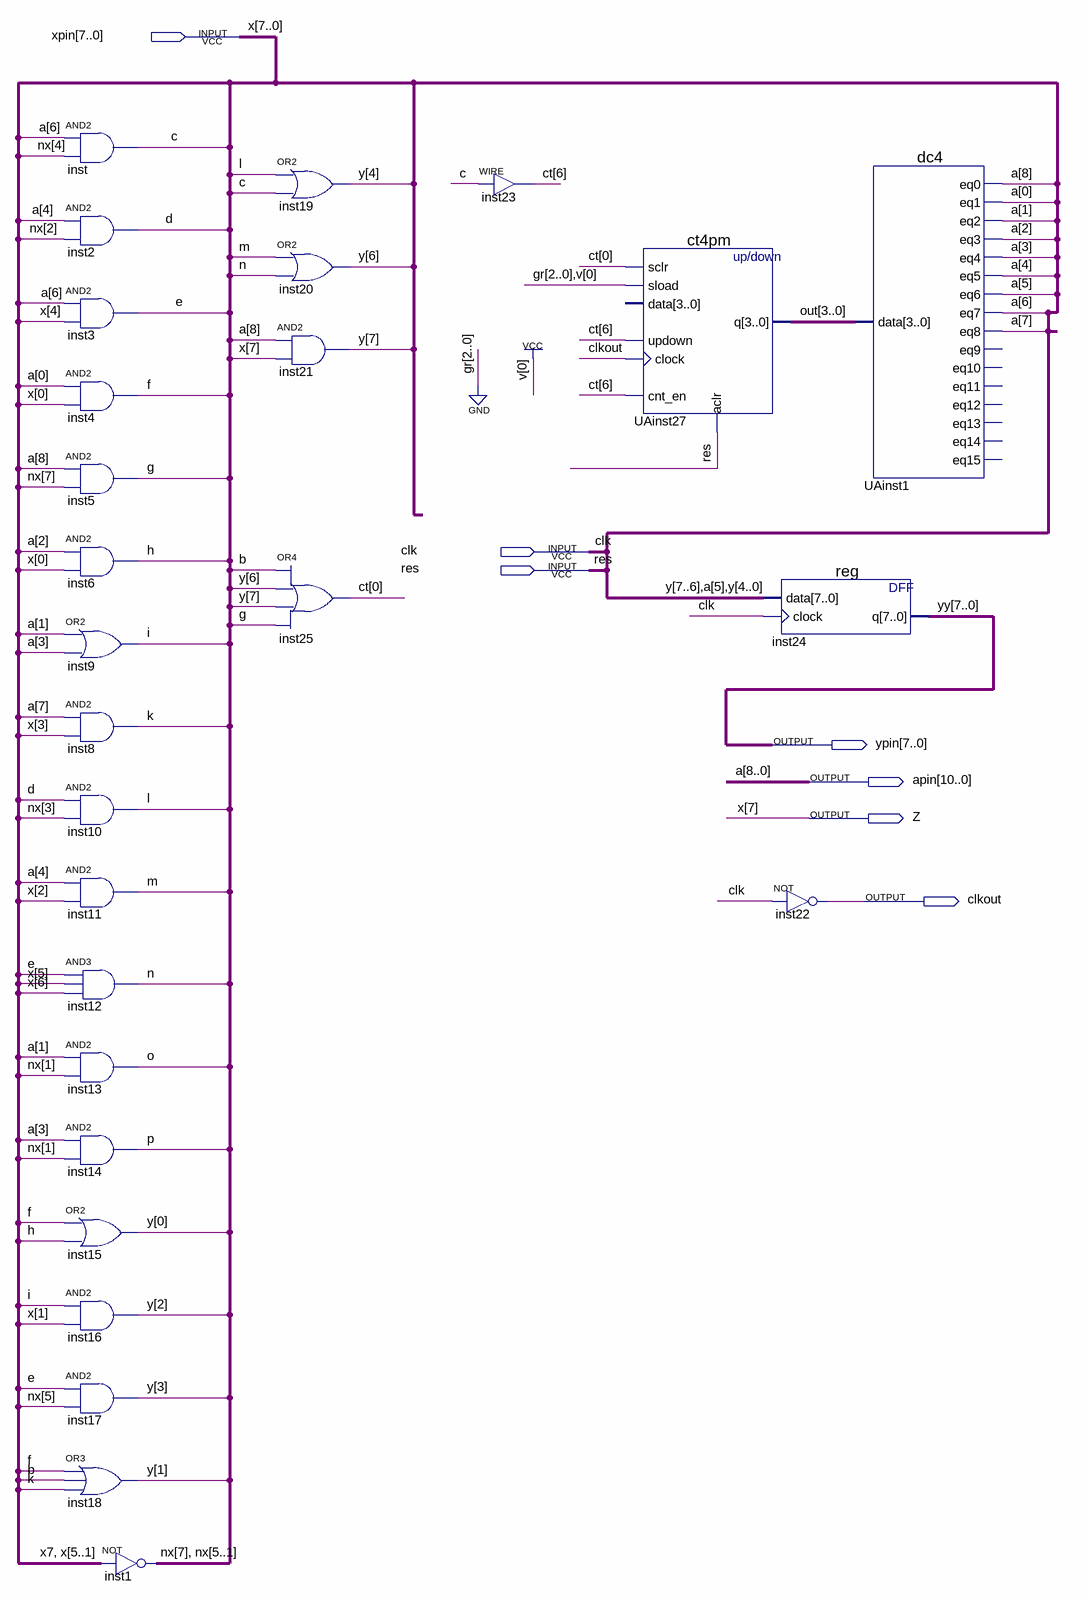
[diagram p0: schematic sheet]
// Quartus schematic Block1.bdf as structural Verilog: 27 symbols, 7 pins
module Block1 (
  input  [7:0] xpin,
  input  clk,
  input  res,
  output [7:0] ypin,
  output [10:0] apin,
  output Z,
  output clkout
);

  wire b, c, d, e, f, g, h, i, k, l, m, n, o, p;
  wire [3:0] out;
  wire [6:0] ct;
  wire [7:0] y;
  wire [7:1] nx;
  wire [8:0] a;

  and inst (c, a[6], nx[4]);
  and inst2 (d, a[4], nx[2]);
  and inst3 (e, a[6], xpin[4]);
  and inst4 (f, a[0], xpin[0]);
  and inst5 (g, a[8], nx[7]);
  and inst6 (h, a[2], xpin[0]);
  or inst9 (i, a[1], a[3]);
  and inst8 (k, a[7], xpin[3]);
  and inst10 (l, d, nx[3]);
  and inst11 (m, a[4], xpin[2]);
  and inst12 (n, e, xpin[5], xpin[6]);
  and inst13 (o, a[1], nx[1]);
  and inst14 (p, a[3], nx[1]);
  or inst15 (y[0], f, h);
  and inst16 (y[2], i, xpin[1]);
  and inst17 (y[3], e, nx[5]);
  or inst18 (y[1], f, b, k);
  assign {nx[7], nx[5:1]} = ~{xpin[7], xpin[5:1]};  // NOT inst1, 6 bits wide
  or inst19 (y[4], l, c);
  or inst20 (y[6], m, n);
  and inst21 (y[7], a[8], xpin[7]);
  or inst25 (ct[0], b, y[6], y[7], g);
  assign ct[6] = c;  // WIRE inst23
  ct4pm UAinst27 (
    .sclr(ct[0]), .sload(4'b0001), .updown(ct[6]), .clock(clkout), .cnt_en(ct[6]), .aclr(res), .q(out));  // open: data
  \reg  inst24 (.data({y[7:6], a[5], y[4:0]}), .clock(clk), .q(ypin));
  not inst22 (clkout, clk);
  dc4 UAinst1 (
    .data(out), .eq0(a[8]), .eq1(a[0]), .eq2(a[1]), .eq3(a[2]), .eq4(a[3]), .eq5(a[4]), .eq6(a[5]),
    .eq7(a[6]), .eq8(a[7]));  // open: eq9, eq10, eq11, eq12, eq13, eq14, eq15

  assign Z = xpin[7];

  // Other names for the same wires on the sheet: x[7:0] = xpin; x7 = xpin[7]; yy[7:0] = ypin
endmodule
